# EAGLE design xmas_tree (EAGLE 7.6.0)
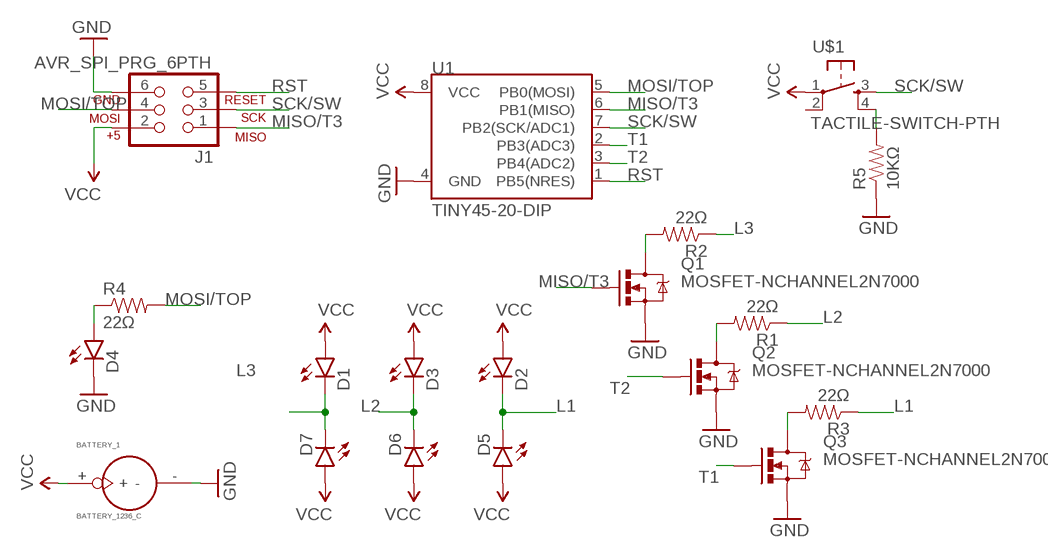
[diagram p0: schematic, sheet 1]

## Parts
BATTERY_1  BATTERY_1236_C  [BATTERY_1236_C]
D1  LED  [LED5MM-SLIM]
D2  LED  [LED5MM-SLIM]
D3  LED  [LED5MM-SLIM]
D4  LED  [LED5MM-SLIM]
D5  LED  [LED5MM-SLIM]
D6  LED  [LED5MM-SLIM]
D7  LED  [LED5MM-SLIM]
J1  AVR_SPI_PRG_6PTH  [2X3]
Q1  MOSFET-NCHANNEL2N7000  [TO-92]
Q2  MOSFET-NCHANNEL2N7000  [TO-92]
Q3  MOSFET-NCHANNEL2N7000  [TO-92]
R1  22Ω  RESISTOR1206  [1206]
R2  22Ω  RESISTOR1206  [1206]
R3  22Ω  RESISTOR1206  [1206]
R4  22Ω  RESISTOR1206  [1206]
R5  10KΩ  RESISTOR1206  [1206]
U1  TINY45-20-DIP  ATTINY45TINY45-20-DIP  [DIP08]
U$1  TACTILE-SWITCH-PTH  [TAC-SWITCH-PTH]

## Nets
GND: BATTERY_1.- D4.K(C) J1.6 Q1.1(S) Q2.1(S) Q3.1(S) R5.1 U1.4(GND)
L1: D2.K(C) D5.K(C) R3.1
L2: D3.K(C) D6.K(C) R1.1
L3: D1.K(C) D7.K(C) R2.1
MISO/T3: J1.1 Q1.2(G) U1.6(PB1(MISO))
MOSI/TOP: J1.4 R4.2 U1.5(PB0(MOSI))
N$2: Q1.3(D) R2.2
N$3: R5.2 U$1.4
N$4: Q2.3(D) R1.2
N$5: Q3.3(D) R3.2
N$6: D4.A R4.1
RST: J1.5 U1.1(PB5(NRES))
SCK/SW: J1.3 U1.7(PB2(SCK/ADC1)) U$1.3
T1: Q3.2(G) U1.2(PB3(ADC3))
T2: Q2.2(G) U1.3(PB4(ADC2))
VCC: BATTERY_1.+ D1.A D2.A D3.A D5.A D6.A D7.A J1.2 U1.8(VCC) U$1.1
Unconnected: U$1.2

## Library data of the parts
BATTERY_1 = Itead_BP_110825.lbr:BATTERY_1236_C: SOC004
D1-D7 = SparkFun-LED:LED: LEDs Standard schematic elements and footprints for 5mm, 3mm, 1206, and 0603 sized LEDs. 5mm - Spark Fun Electronics SKU : COM-00529 (and others)
J1 = SparkFun-Connectors:AVR_SPI_PRG_6: AVR ISP 6 Pin This is the reduced ISP connector for AVR programming. Common on Arduino. This footprint will take up less PCB space and can be used with a 10-pin to 6-pin adapter such as SKU: BOB-08508 **Special note about "TEST_POINT" package. The stop mask is on the top side, so if you want your programming test points to be on the bottom of your board, make sure to place this package on the bottom side of the board. This also ensure that the orientation to program from the bottom side will be correct.
Q1-Q3 = SparkFun-DiscreteSemi:MOSFET-NCHANNEL: Common NMOSFET Parts MFG P/N Store ID Prod ID FDD8780 TRANS-09984 SI7820DN TRANS-11055 FDS6630A IC-08089 2N7002PW TRANS-11151 FQP30N06L COM-10213 TRANS-10060 BSS123LT1G TRANS-08345 BSS138 TRANS-00830 BS170 2N7000
R1-R5 = SparkFun-Passives:RESISTOR: Resistor Basic schematic elements and footprints for 0603, 1206, and PTH resistors.
U1 = SparkFun-DigitalIC:ATTINY45: Atmel 8-pin 2/4/8kB flash uC; PROD_ID: IC-09439
U$1 = GeekAmmo:TACTILE-SWITCH: Tactile Switch 4 Pins, SPST NO

## Board
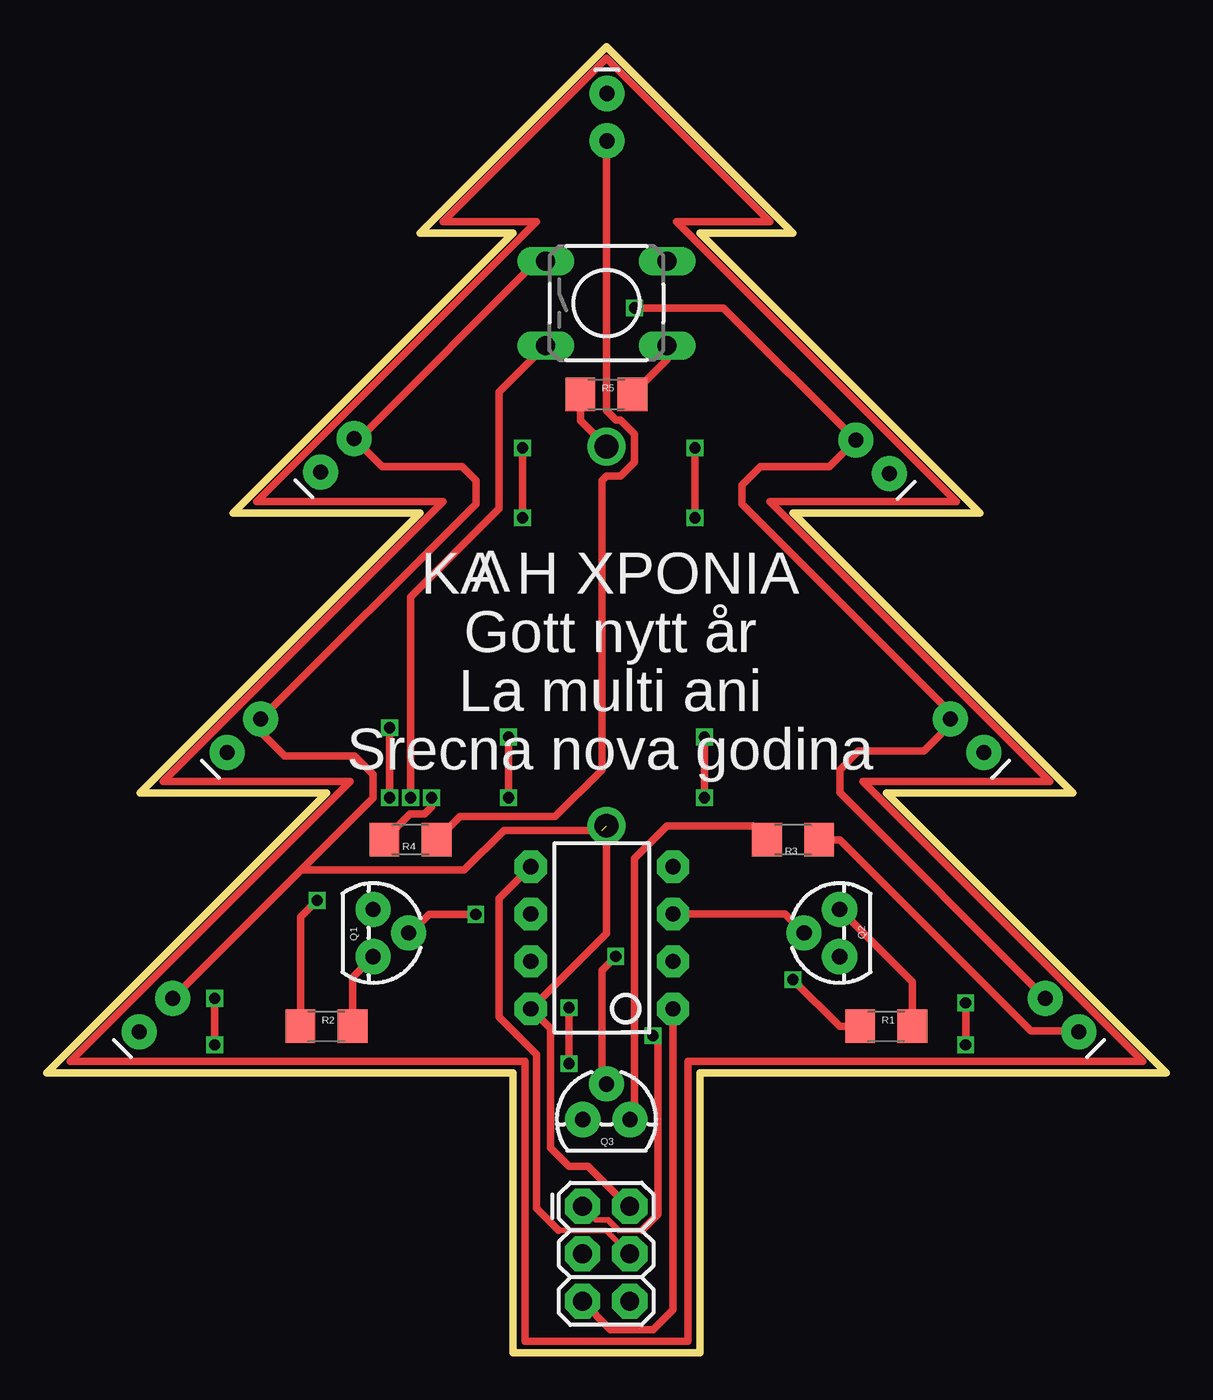
[diagram p1: board, top side]
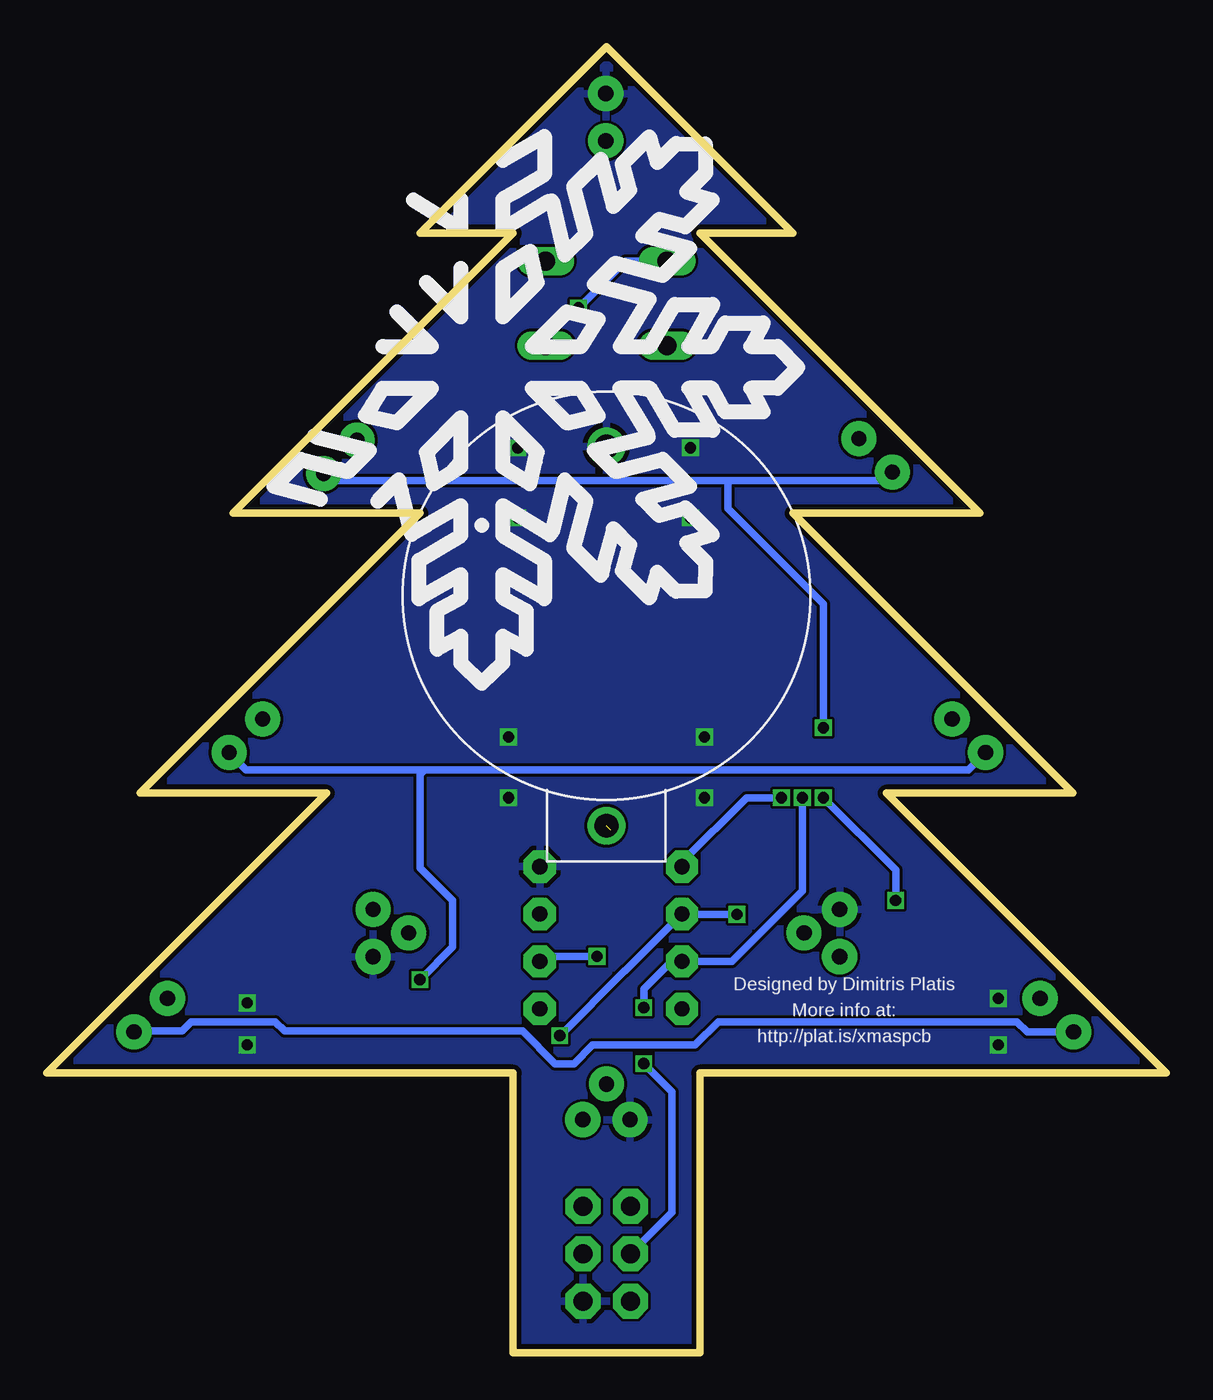
[diagram p2: board, bottom side, seen from below]

Size 60 x 70 mm. Coordinates in mm from the lower left corner, seen from the top.
Outline: 35,0 35,15 60,15 45,30 55,30 40,45 50,45 35,60 40,60 30,70 20,60 25,60 10,45 20,45 5,30 15,30 0,15 25,15 25,0 35,0
Copper layers (1*16): Top 0.035mm / dielectric 1.5mm / Bottom 0.035mm
Design rules "SeeedStudio_2layer_DRU_no_angle_20140221": minimum track width 6mil, minimum drill 12mil, track to track 6mil, track to pad 6mil, pad to pad 6mil, via to via 6mil, smd to smd 0mil, copper to edge 10mil, drill to drill 10mil, minimum pad ring 10mil, minimum via ring 6mil, stop-mask expansion 2mil, vias tented up to drill 100mil, thermal gap 10mil

### Footprints (pad centres in the part's own frame; a part is rotated, then mirrored left to right if it is on the bottom)
BATTERY_1236_C = drill 1.27 pad 2.032: + 0,0; - 0,20.32
LED5MM-SLIM = drill 0.813 pad 1.88: A -1.27,0; K 1.27,0
2X3 = drill 1.016 pad 1.88 octagon: 1 0,0; 2 0,2.54; 3 2.54,0; 4 2.54,2.54; 5 5.08,0; 6 5.08,2.54
TO-92 = drill 0.813 pad 1.88: 1 -1.27,0; 2 0,1.905; 3 1.27,0
1206 = smd 1.6 x 1.8: 1 -1.4,0; 2 1.4,0
DIP08 = drill 0.813 pad 1.727 octagon: 1 -3.81,-3.81; 2 -1.27,-3.81; 3 1.27,-3.81; 4 3.81,-3.81; 5 3.81,3.81; 6 1.27,3.81; 7 -1.27,3.81; 8 -3.81,3.81
TAC-SWITCH-PTH = drill 1.016 pad 1.524 long: 1 -3.251,2.261; 2 3.251,2.261; 3 -3.251,-2.261; 4 3.251,-2.261

### Placement (x,y rotation side)
BATTERY_1  30,28.25 0 bottom
D1  44.27,48.02 315 top
D2  54.42,18.1 315 top
D3  49.32,33.07 315 top
D4  30.03,66.22 90 top
D5  5.86,18.1 225 top
D6  10.58,33.08 225 top
D7  15.58,48.1 225 top
J1  28.71,7.85 270 top
Q1  17.5,22.5 270 top
Q2  42.5,22.5 90 top
Q3  30,12.5 0 top
R1  45,17.5 0 top
R2  15,17.5 0 top
R3  40,27.5 180 top
R4  19.5,27.5 180 top
R5  30,51.38 0 top
U1  29.76,22.25 90 top
U$1  30,56.25 0 top

### Tracks (layer width: path | path; a pad name or v marks a point on that pad's centre or on a via)
GND  (via drill 0.6)
  Top 0.406: BATTERY_1.- 28.6,49.97 R5.1 | v25.5,48.5 v25.5,44.75 | v34.75,48.5 v34.75,44.75 | v24.75,29.75 v24.75,33 | v35.25,29.75 v35.25,33 | v9,19 v9,16.5 | v49.25,18.75 v49.25,16.5
  pour Bottom: 1.25,70.62 60,70.62 61.88,68.75 61.88,-1.25 16.88,-1.25 -3.75,-1.25 -3.75,69.38 -2.5,70.62
L1
  Top 0.406: R3.1 42.5,27.5 52.75,17.25 55.27,17.25 D2.K
  Bottom 0.406: D2.K 55.27,17.25 52.75,17.25 52.25,17.75 47.75,17.75 47.25,17.25 34.5,17.25 32.75,15.5 31.75,15.5 30.75,16.5 25.25,16.5 24,17.75 8,17.75 7.45,17.2 D5.K
L2  (via drill 0.6)
  Top 0.406: R1.1 42.5,17.5 v40,20
  Bottom 0.406: D6.K 10.61,31.25 39.75,31.25 | 39.75,31.25 49.3,31.25 D3.K | v40,20 38.25,21.75 38.25,24.25 40,26 40,31 39.75,31.25
L3  (via drill 0.6)
  Top 0.406: R2.1 13.6,23.35 v14.5,24.25 | v18.38,29.75 v18.38,33.5
  Bottom 0.406: D7.K 15.13,46.75 23.5,46.75 | 23.5,46.75 44.79,46.75 D1.K | v14.5,24.25 14.5,25.88 v18.38,29.75 | 23.5,46.75 23.5,45.25 18.38,40.12 v18.38,33.5
MISO/T3  (via drill 0.6)
  Top 0.305: J1.1 29.42,7.14 30.09,7.14 30.65,6.58 31.91,6.58
  Top 0.406: v32.5,17 32.75,16.75 32.75,7.42 31.91,6.58 | Q1.2 19.5,22.5 20.5,23.5 v23,23.5
  Bottom 0.406: v32.5,17 29.03,20.46 29,20.46 U1.6 25.94,23.5 v23,23.5
MOSI/TOP  (via drill 0.6)
  Top 0.305: J1.4 29.98,6.58 27.42,6.58
  Top 0.406: U1.5 24.25,24.36 24.25,18 26.25,16 26.25,7.75 27.42,6.58 | R4.2 19.48,28.88 20.25,28.88 20.62,29.25 v20.62,29.75
  Bottom 0.406: v20.62,29.75 22.5,29.75 25.95,26.3 U1.5
N$1
  Top 0.406: 30,69.38 21.25,60.62 26.25,60.62 11.25,45.62 21.25,45.62 6.25,30.62 16.25,30.62 1.25,15.62 25.62,15.62 25.62,0.62 34.38,0.62 34.38,15.62 58.75,15.62 43.75,30.62 53.75,30.62 38.75,45.62 48.75,45.62 33.75,60.62 38.75,60.62 30,69.38
N$2
  Top 0.406: R2.2 16.4,20.13 Q1.3
N$3
  Top 0.406: R5.2 33.25,53.23 U$1.4
N$4
  Top 0.406: R1.2 46.4,19.87 Q2.3
N$5
  Top 0.406: R3.2 37.85,28.25 33.25,28.25 31.5,26.5 31.5,12.73 Q3.3
N$6
  Top 0.406: D4.A 30,64.99 30,50.5 30.5,50 30.75,50 31.5,49.25 31.5,47.75 30.75,47 30,47 29.75,46.75 29.75,31.25 27.25,28.75 22.15,28.75 R4.1
RST
  Top 0.406: U1.1 33.57,2.32 32.5,1.25 30.23,1.25 J1.5
SCK/SW  (via drill 0.6)
  Top 0.406: v28,15.5 v28,18.5 | v19.5,29.75 19.5,40.5 24.25,45.25 24.25,51.49 U$1.3
  Bottom 0.406: J1.3 26.5,7.52 26.5,14 v28,15.5 | v28,18.5 28,19.5 26.52,20.98 U1.7 23.27,20.98 19.5,24.75 v19.5,29.75
T1  (via drill 0.6)
  Top 0.406: Q3.2 29.75,14.65 29.75,20.5 v30.5,21.25
  Bottom 0.406: U1.2 33.3,21.25 v30.5,21.25
T2
  Top 0.406: U1.3 39.58,23.52 Q2.2
VCC  (via drill 0.6)  (1 unrouted)
  Top 0.406: J1.2 31.15,7.85 29,10 28,10 27,11 27,17.39 U1.8 30,22.48 BATTERY_1.+ | v31.5,56 36.28,56 D1.A 41.95,47.5 38.25,47.5 37.25,46.5 37.25,45.5 48.43,34.32 D3.A 48.43,33.68 47,32.25 43.5,32.25 42.5,31.25 42.5,30.02 D2.A | D6.A 23,45.5 23,46.75 22.25,47.5 17.97,47.5 D7.A 16.73,49.25 17,49.25 26.26,58.51 U$1.1 | D5.A 13.63,25.87 | 13.63,25.87 17.5,29.74 17.5,31 16.5,32 12.75,32 11.47,33.28 D6.A | 11.47,33.53 D6.A | 13.63,25.87 22.37,25.87 24.5,28 29.75,28
  Bottom 0.406: U$1.1 28.99,58.51 v31.5,56

### Text on the board
tPlace: V | KA H XPONIA / Gott nytt år / La multi ani / Srecna nova godina
bPlace: Designed by Dimitris Platis / More info at: / http://plat.is/xmaspcb